# EAGLE schematic magnetophone (EAGLE 7.2.0)
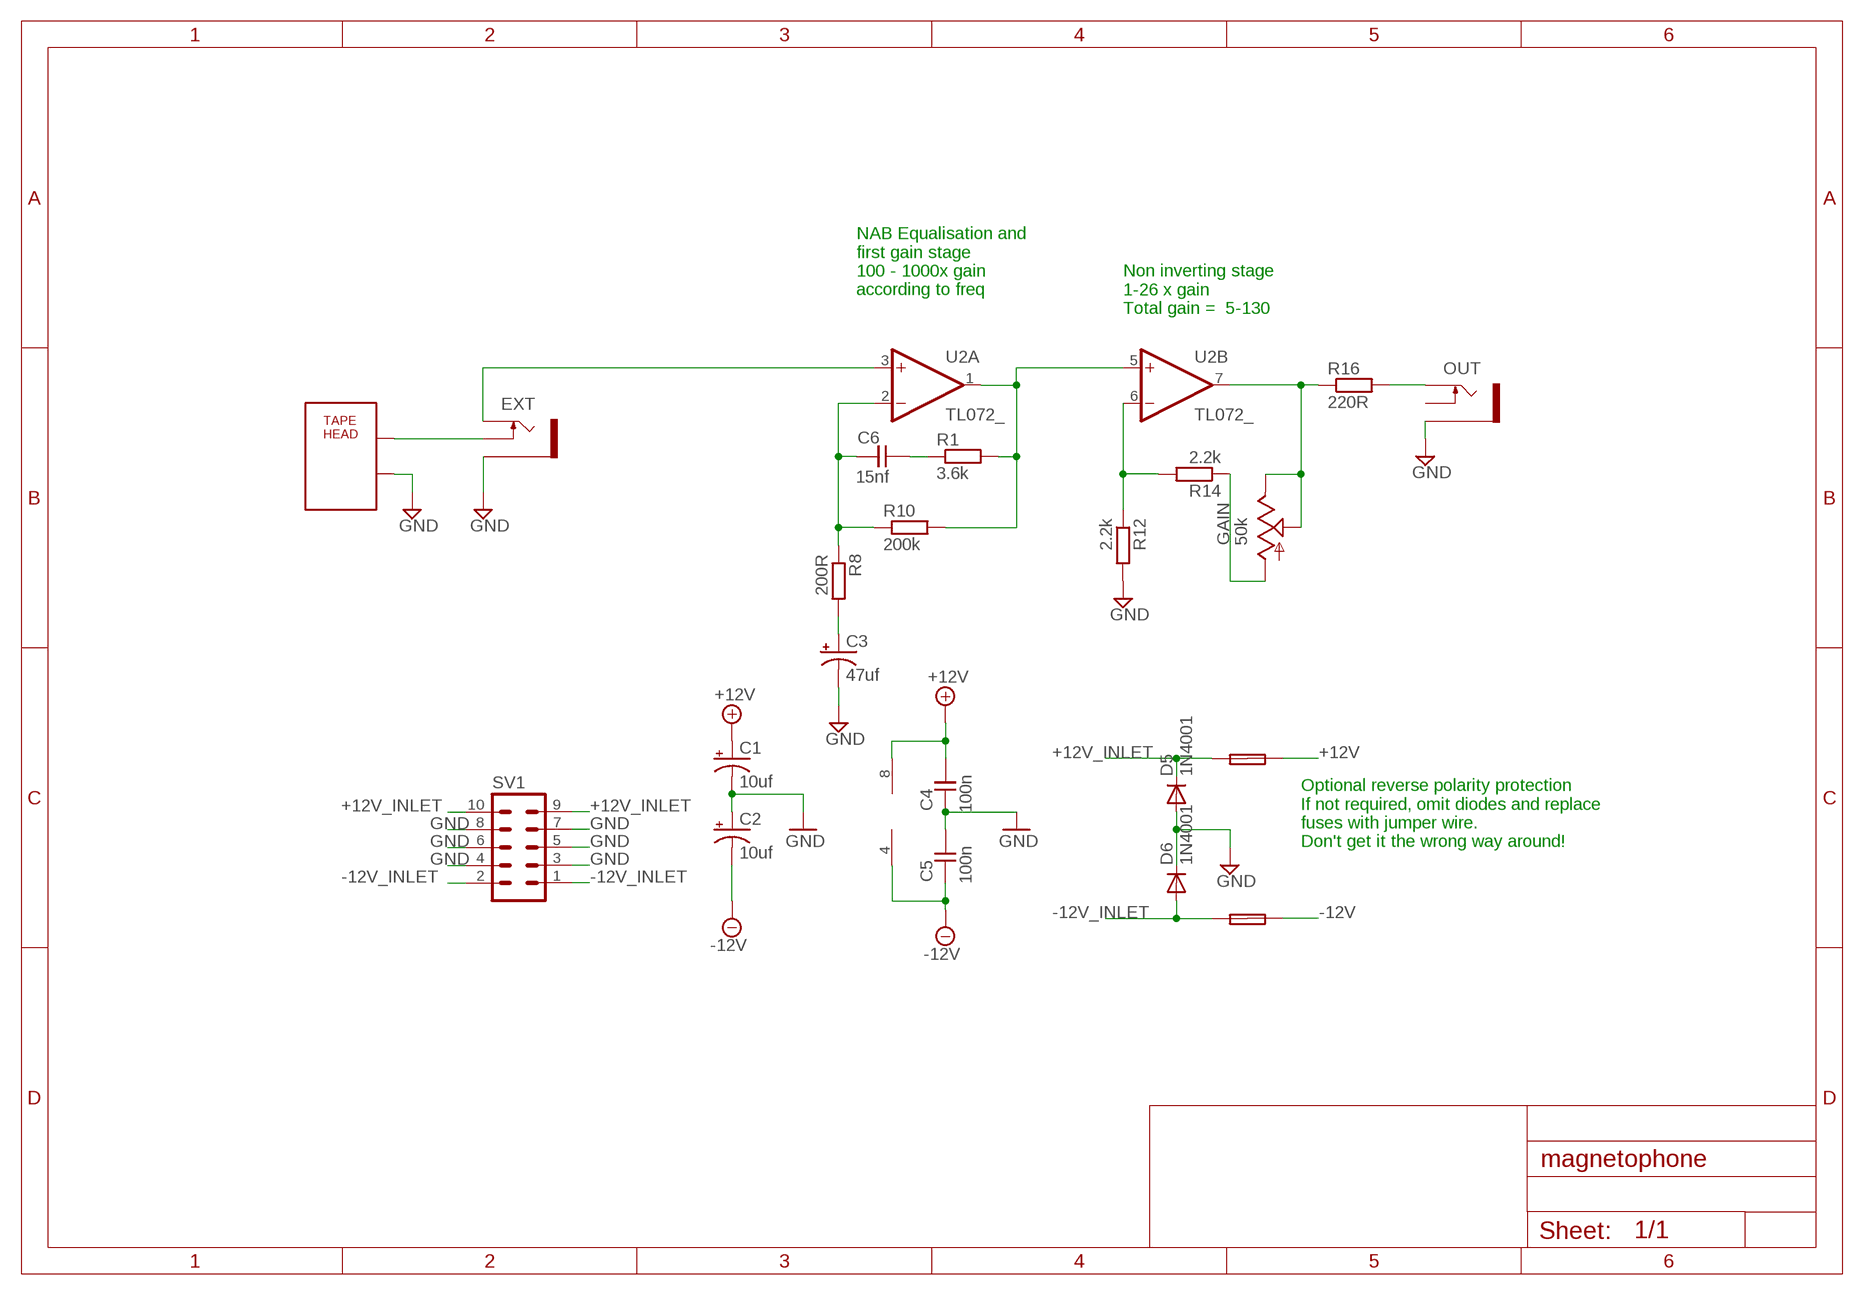
[diagram p0: schematic, sheet 1]

## Parts
1  FUSE  PTC_FUSEPOLY_FUSE  [C050H075X075]
C1  10uf  CAP_POLPTH2  [CPOL-RADIAL-10UF-25V]
C2  10uf  CAP_POLPTH2  [CPOL-RADIAL-10UF-25V]
C3  47uf  CAP_POLPTH2  [CPOL-RADIAL-10UF-25V]
C4  100n  C-EU050-024X044  [C050-024X044]
C5  100n  C-EU050-024X044  [C050-024X044]
C6  15nf  C-EU050-024X044  [C050-024X044]
D5  1N4001  1N4004  [DO41-10]
D6  1N4001  1N4004  [DO41-10]
EXT  THONKICONNNEW  [WQP-PJ301M-12_JACK]
FUSE  FUSE  PTC_FUSEPOLY_FUSE  [C050H075X075]
GAIN  50k  ALPHA-9MMF2A  [EVUF]
OUT  THONKICONNNEW  [WQP-PJ301M-12_JACK]
R1  3.6k  RESISTOR7MM  [7MM_RESISTOR]
R8  200R  RESISTOR7MM  [7MM_RESISTOR]
R10  200k  RESISTOR7MM  [7MM_RESISTOR]
R12  2.2k  RESISTOR7MM  [7MM_RESISTOR]
R14  2.2k  RESISTOR7MM  [7MM_RESISTOR]
R16  220R  RESISTOR7MM  [7MM_RESISTOR]
SV1  10_PIN_HEADER  [MA05-2]
U2  TL072_  [DIL08]
U$1  MONO_CASSETTE_HEAD  [MONO_CASSETTE_HEAD]

## Nets
+12V [power]: 1.2 C1.1(+) C4.1 U2.8(P:V+)
+12V_INLET: 1.1 D5.C SV1.9 SV1.10
-12V [power]: C2.2(-) C5.2 FUSE.2 U2.4(P:V-)
-12V_INLET: D6.A FUSE.1 SV1.1 SV1.2
GND [ground]: C1.2(-) C2.1(+) C3.2(-) C4.2 C5.1 D5.A D6.C EXT.P$3_SLEEVE(SLEEVE) OUT.P$3_SLEEVE(SLEEVE) R12.2 SV1.3 SV1.4 SV1.5 SV1.6 SV1.7 SV1.8 U$1.P$2
N$1: EXT.P$2_SWITCH(SWITCH) U$1.P$1
N$2: EXT.P$1_TIP(TIP) U2.3(A:+IN)
N$3: C6.2 R8.1 R10.1 U2.2(A:-IN)
N$4: R1.2 R10.2 U2.1(A:OUT) U2.5(B:+IN)
N$5: GAIN.1(A) R14.1
N$6: R12.1 R14.2 U2.6(B:-IN)
N$7: C3.1(+) R8.2
N$8: GAIN.2(S) GAIN.3(E) R16.1 U2.7(B:OUT)
N$9: C6.1 R1.1
N$10: OUT.P$1_TIP(TIP) R16.2
Unconnected: OUT.P$2_SWITCH(SWITCH)

## Notes on the sheet
- NAB Equalisation and 
  first gain stage
  100 - 1000x gain 
  according to freq
- Non inverting stage
  1-26 x gain
  Total gain =  5-130
- Optional reverse polarity protection
  If not required, omit diodes and replace
  fuses with jumper wire. 
  Don't get it the wrong way around!

## Library data of the parts
1 FUSE = TomW:PTC_FUSE
C1-C3 = SparkFun-Passives:CAP_POL: Capacitor Polarized These are standard SMD and PTH capacitors. Normally 10uF, 47uF, and 100uF in electrolytic and tantalum varieties. Always verify the external diameter of the through hole cap, it varies with capacity, voltage, and manufacturer. The EIA devices should be standard.
C4-C6 = TomW:C-EU: CAPACITOR, European symbol
D5 D6 = diode:1N4004: DIODE general purpose rectifier, 1 A
EXT OUT = MusicThingModular:THONKICONN: 3.5mm socket for Eurorack modular synths
GAIN = TomW:ALPHA-9MM: 9 mm Square Rotary Potentiometers Source: Panasonic
R1 R8 R10 R12 R14 R16 = MusicThingModular:RESISTOR: Standard resistor, various versions
SV1 = TomW:10_PIN_HEADER: PIN HEADER; OC_FARNELL: unknown; OC_NEWARK: unknown
U2 = MusicThingModular:TL072: Generic Dual Op Amp
U$1 = MusicThingModular:MONO_CASSETTE_HEAD

## Net classes
0 default: width 0.61 mm
1 power: width 0.61 mm
2 ground: width 0.61 mm